# EAGLE design webradio (EAGLE 7.7.0)
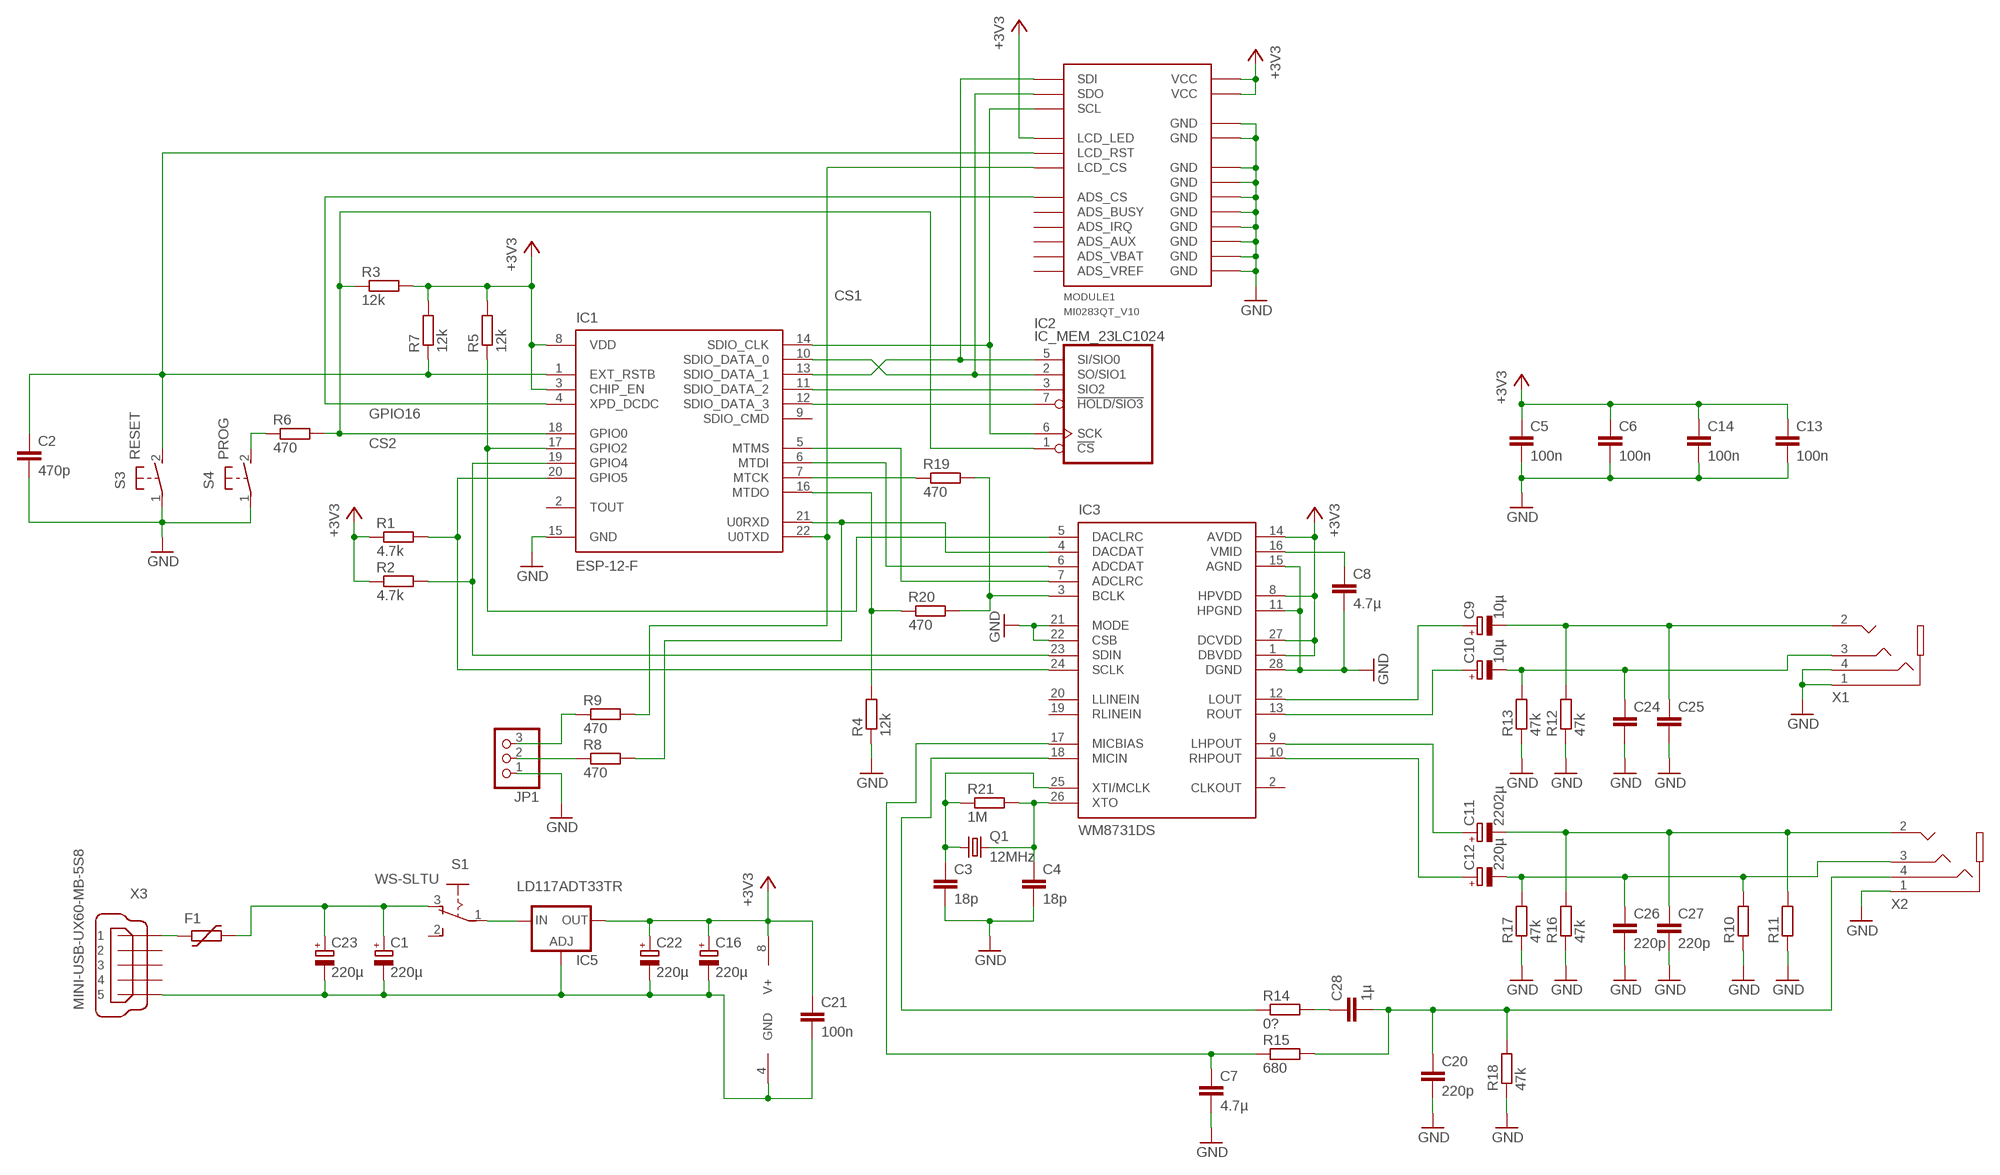
[diagram p0: schematic, sheet 1]

## Parts
C1  220µ  CPOL-EUB/3528-21R  [B/3528-21R]
C2  470p  C-EUC0805  [C0805]
C3  18p  C-EUC0805  [C0805]
C4  18p  C-EUC0805  [C0805]
C5  100n  C-EUC0805  [C0805]
C6  100n  C-EUC0805  [C0805]
C7  4.7µ  C-EUC0805  [C0805]
C8  4.7µ  C-EUC0805  [C0805]
C9  10µ  CPOL-EUA/3216-18R  [A/3216-18R]
C10  10µ  CPOL-EUA/3216-18R  [A/3216-18R]
C11  2202µ  CPOL-EUD/7343-31R  [D/7343-31R]
C12  220µ  CPOL-EUD/7343-31R  [D/7343-31R]
C13  100n  C-EUC0805  [C0805]
C14  100n  C-EUC0805  [C0805]
C16  220µ  CPOL-EUB/3528-21R  [B/3528-21R]
C20  220p  C-EUC0805  [C0805]
C21  100n  C-EUC0805  [C0805]
C22  220µ  CPOL-EUB/3528-21R  [B/3528-21R]
C23  220µ  CPOL-EUB/3528-21R  [B/3528-21R]
C24  C-EUC0805  [C0805]
C25  C-EUC0805  [C0805]
C26  220p  C-EUC0805  [C0805]
C27  220p  C-EUC0805  [C0805]
C28  1µ  C-EUC0805  [C0805]
F1  FUSE_PTC-1812  [PTC1812L]
IC1  ESP-12-F  [ESP-12-F]
IC2  IC_MEM_23LC1024  [SOIC-8]
IC3  WM8731DS  [SSOP28]
IC5  LD117ADT33TR  [DPACK]
JP1  PINHD-1X3/90  [1X03/90]
MODULE1  MI0283QT_V10  [MI0283QT_V10]
Q1  12MHz  CRYSTALHC49UP  [HC49UP]
R1  4.7k  R-EU_R0805  [R0805]
R2  4.7k  R-EU_R0805  [R0805]
R3  12k  R-EU_R0805  [R0805]
R4  12k  R-EU_R0805  [R0805]
R5  12k  R-EU_R0805  [R0805]
R6  470  R-EU_R0805  [R0805]
R7  12k  R-EU_R0805  [R0805]
R8  470  R-EU_R0805  [R0805]
R9  470  R-EU_R0805  [R0805]
R10  R-EU_R0805  [R0805]
R11  R-EU_R0805  [R0805]
R12  47k  R-EU_R0805  [R0805]
R13  47k  R-EU_R0805  [R0805]
R14  0?  R-EU_R0805  [R0805]
R15  680  R-EU_R0805  [R0805]
R16  47k  R-EU_R0805  [R0805]
R17  47k  R-EU_R0805  [R0805]
R18  47k  R-EU_R0805  [R0805]
R19  470  R-EU_R0805  [R0805]
R20  470  R-EU_R0805  [R0805]
R21  1M  R-EU_R0805  [R0805]
S1  WS-SLTU  [450302014072]
S3  RESET  31-XX  [B3F-31XX]
S4  PROG  31-XX  [B3F-31XX]
X1  SJ-43514-SMT  [SJ-43514-SMT]
X2  SJ-43514-SMT  [SJ-43514-SMT]
X3  MINI-USB-UX60-MB-5S8  [UX60-MB-5S8]

## Nets
+3V3: C5.1 C6.1 C13.1 C14.1 C16.+ C21.1 C22.+ IC1.3(CHIP_EN) IC1.8(VDD) IC2.8(V+) IC3.1(DBVDD) IC3.8(HPVDD) IC3.14(AVDD) IC3.27(DCVDD) IC5.4(OUT) MODULE1.3_VCC(VCC) MODULE1.4_VCC(VCC) MODULE1.5_LCD_LED(LCD_LED) R1.1 R2.1 R3.2 R5.2 R7.2
GND: C1.- C2.2 C3.2 C4.2 C5.2 C6.2 C7.2 C8.2 C13.2 C14.2 C16.- C20.2 C21.2 C22.- C23.- C24.2 C25.2 C26.2 C27.2 IC1.15(GND) IC2.4(GND) IC3.11(HPGND) IC3.15(AGND) IC3.21(MODE) IC3.22(CSB) IC3.28(DGND) IC5.1(ADJ) JP1.1 MODULE1.1_GND(GND) MODULE1.2_GND(GND) MODULE1.GND_1(GND) MODULE1.GND_2(GND) MODULE1.GND_3(GND) MODULE1.GND_4(GND) MODULE1.GND_5(GND) MODULE1.GND_6(GND) MODULE1.GND_7(GND) MODULE1.GND_8(GND) R4.1 R10.1 R11.1 R12.1 R13.1 R16.1 R17.1 R18.1 S3.1(P) S4.1(P) X1.1 X1.4 X2.1 X3.5
N$1: IC1.14(SDIO_CLK) IC2.6(SCK) MODULE1.10_SCL(SCL)
N$2: IC1.18(GPIO0) IC2.1(!CS) R3.1 R6.2
N$3: F1.1 X3.1
N$4: IC1.10(SDIO_DATA_0) IC2.2(SO/SIO1) MODULE1.9_SDO(SDO)
N$5: IC1.11(SDIO_DATA_2) IC2.3(SIO2)
N$6: IC1.12(SDIO_DATA_3) IC2.7(!HOLD/SIO3)
N$7: IC1.16(MTDO) R4.2 R20.1
N$8: IC1.21(U0RXD) IC3.4(DACDAT) R8.2
N$9: IC1.17(GPIO2) IC3.5(DACLRC) R5.1
N$10: IC1.19(GPIO4) IC3.23(SDIN) R2.2
N$11: IC1.20(GPIO5) IC3.24(SCLK) R1.2
N$12: R6.1 S4.2(S)
N$13: JP1.2 R8.1
N$14: C2.1 IC1.1(EXT_RSTB) MODULE1.6_LCD_RST(LCD_RST) R7.1 S3.2(S)
N$15: IC1.22(U0TXD) MODULE1.7_LCD_CS(LCD_CS) R9.2
N$16: JP1.3 R9.1
N$17: C3.1 IC3.25(XTI/MCLK) Q1.1 R21.1
N$18: C4.1 IC3.26(XTO) Q1.2 R21.2
N$19: C1.+ C23.+ F1.2 S1.3(O)
N$20: C8.1 IC3.16(VMID)
N$21: C10.+ IC3.13(ROUT)
N$22: C9.+ IC3.12(LOUT)
N$23: C9.- C25.1 R12.2 X1.2
N$24: C10.- C24.1 R13.2 X1.3
N$25: C12.+ IC3.10(RHPOUT)
N$26: C11.+ IC3.9(LHPOUT)
N$27: C11.- C27.1 R11.2 R16.2 X2.2
N$28: C12.- C26.1 R10.2 R17.2 X2.3
N$29: IC5.3(IN) S1.1(P)
N$30: C7.1 IC3.17(MICBIAS) R15.1
N$31: IC3.18(MICIN) R14.1
N$32: C28.1 R14.2
N$33: C20.1 C28.2 R15.2 R18.2 X2.4
N$34: IC1.6(MTDI) IC3.6(ADCDAT)
N$35: IC1.5(MTMS) IC3.7(ADCLRC)
N$37: IC1.7(MTCK) R19.1
N$38: IC3.3(BCLK) R19.2 R20.2
N$39: IC1.13(SDIO_DATA_1) IC2.5(SI/SIO0) MODULE1.8_SDI(SDI)
N$41: IC1.4(XPD_DCDC) MODULE1.11_ADS_CS(ADS_CS)
Unconnected: IC1.2(TOUT) IC1.9(SDIO_CMD) IC3.2(CLKOUT) IC3.19(RLINEIN) IC3.20(LLINEIN) MODULE1.12_ADS_BUSY(ADS_BUSY) MODULE1.13_ADS_IRQ(ADS_IRQ) MODULE1.14_ADS_AUX(ADS_AUX) MODULE1.15_ADS_VBAT(ADS_VBAT) MODULE1.16_ADS_VREF(ADS_VREF) S1.2(S) X3.2 X3.3 X3.4

## Notes on the sheet
- CS1
- GPIO16
- CS2

## Library data of the parts
C1 C9-C12 C16 C22 C23 = rcl:CPOL-EU: POLARIZED CAPACITOR, European symbol
C2-C8 C13 C14 C20 C21 C24-C28 = rcl:C-EU: CAPACITOR, European symbol
F1 = dp_devices:FUSE_PTC: Resettable PTC
IC1 = ai-thinker:ESP-12-F
IC2 = dp_devices:IC_MEM_23LC1024: 1Mbit SPI SRAM with Serial dual interface and Serial quad interface
IC3 = cirrus-logic-sven:WM8731
IC5 = v-reg:LD117A?*: Low drop fixed and adjustable positive voltage regulators 1 A Source: http://www.st.com/stonline/products/literature/ds/7194/ld1117axx.pdf
JP1 = pinhead:PINHD-1X3: PIN HEADER
MODULE1 = MI0283QT:MI0283QT_V10
Q1 = crystal:CRYSTAL: CRYSTAL; OC_FARNELL: unknown; OC_NEWARK: unknown
R1-R21 = rcl:R-EU_: RESISTOR, European symbol
S1 = switch-wuerth:WS-SLTU: WS-SLTU 10mmx2,5mm right angle mini Slide Swith, THT version, Opposite side connection
S3 S4 = switch-omron:31-XX: OMRON SWITCH
X1 X2 = con-cui:SJ-43514-SMT
X3 = con-hirose:MINI-USB-: MINI USB Connector Source: http://www.hirose.co.jp/cataloge_hp/e24000019.pdf; OC_FARNELL: unknown; OC_NEWARK: unknown

## Net classes
0 default: clearance 0.205 mm

## Board
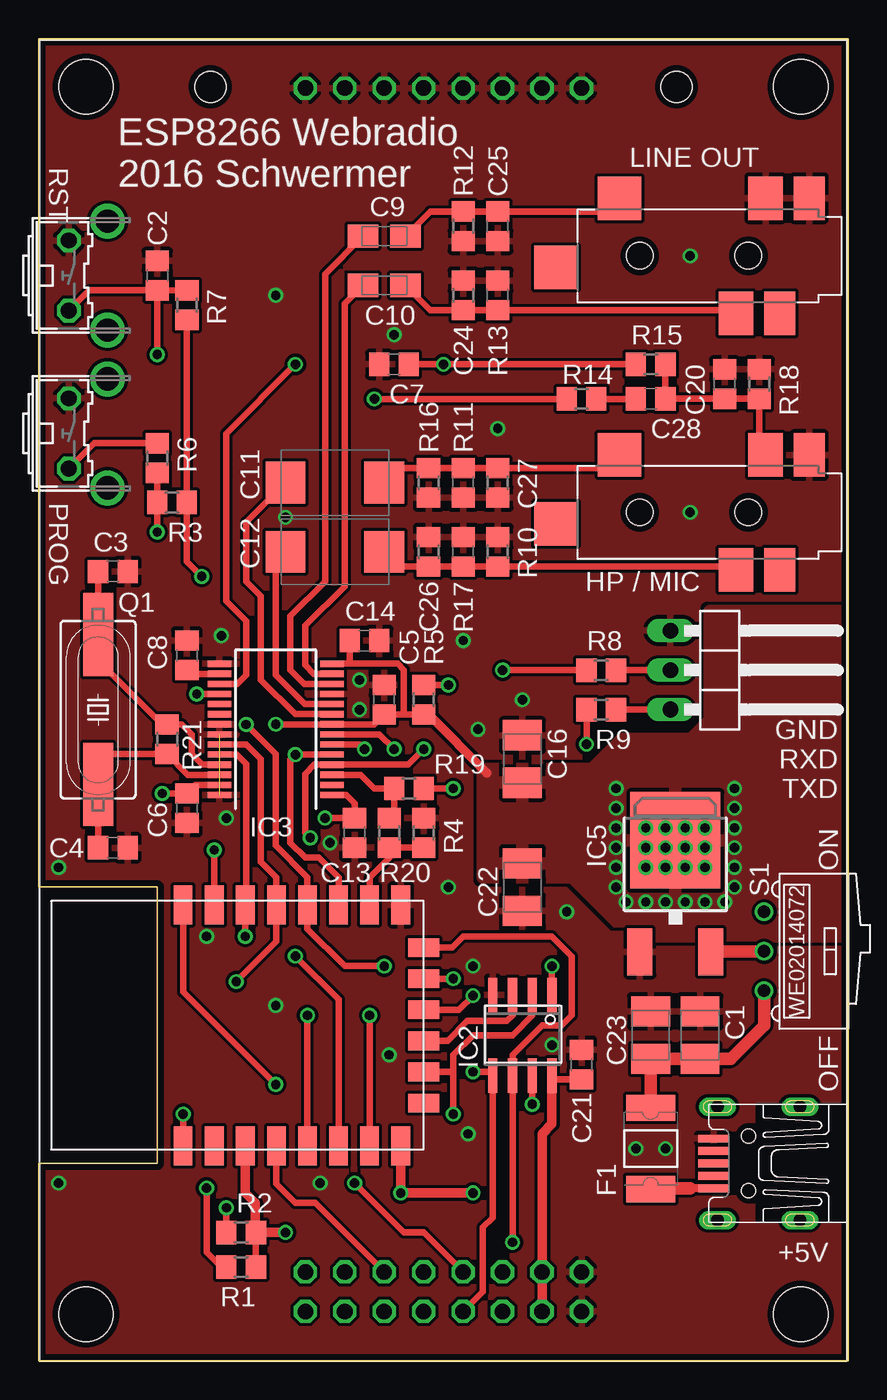
[diagram p1: board, top side]
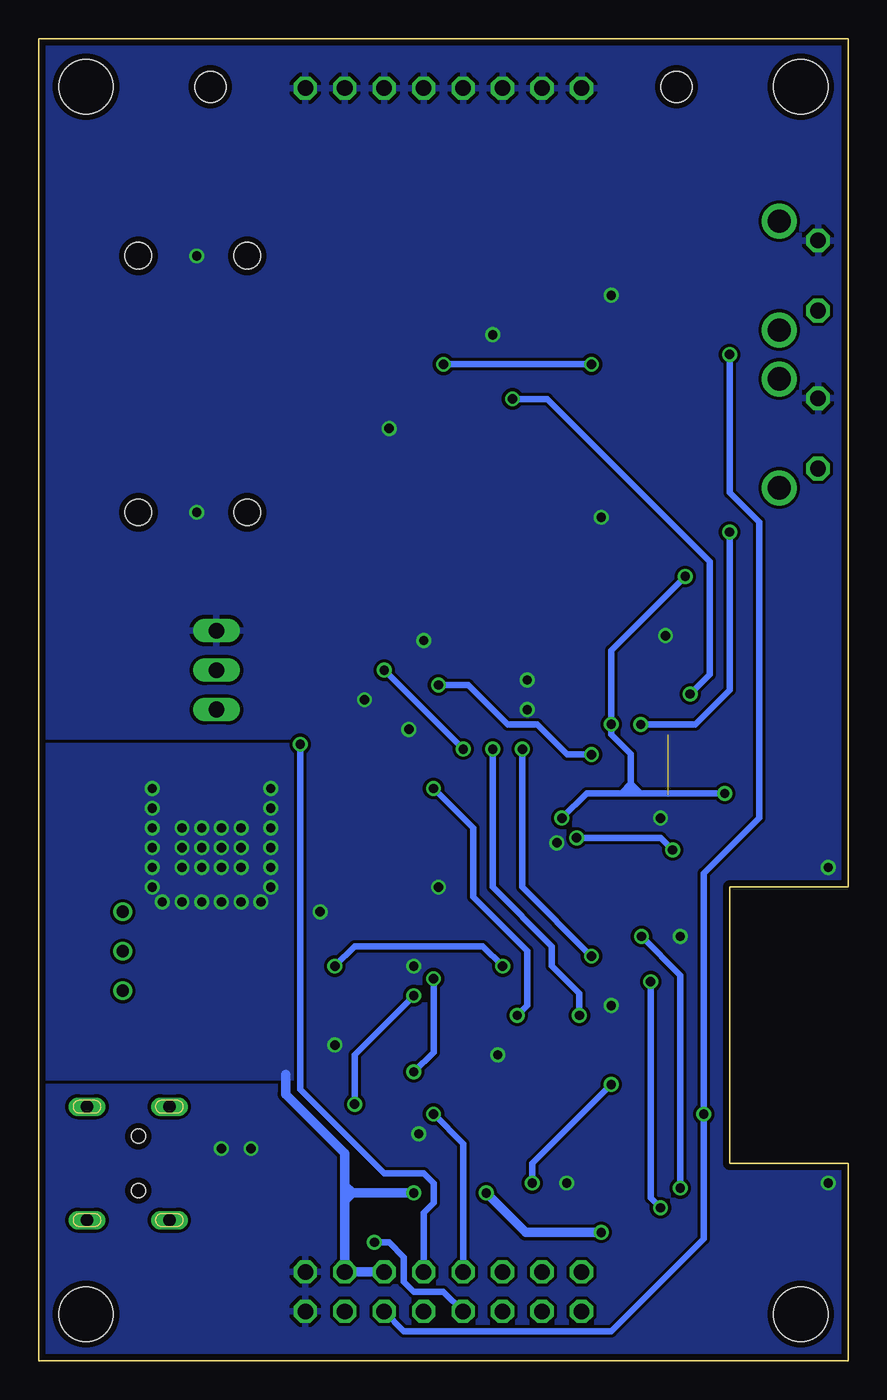
[diagram p2: board, bottom side, seen from below]

Size 52.07 x 85.09 mm. Coordinates in mm from the lower left corner, seen from the top.
Outline: 0,0 52.07,0 52.07,85.09 0,85.09 0,30.48 7.62,30.48 7.62,12.7 0,12.7 0,0
Copper layers (1*16): Top 0.0356mm / dielectric 1.5011mm / Bottom 0.0356mm
Design rules "osh_park": minimum track width 6mil, minimum drill 13mil, track to track 6mil, track to pad 6mil, pad to pad 6mil, via to via 6mil, smd to smd 6mil, copper to edge 15mil, drill to drill 6mil, minimum pad ring 7mil, minimum via ring 7mil, stop-mask expansion 3mil, vias tented up to drill 0mil, thermal gap 10mil

### Footprints (pad centres in the part's own frame; a part is rotated, then mirrored left to right if it is on the bottom)
B/3528-21R = smd 1.95 x 2.5: + 1.525,0; - -1.525,0
C0805 = smd 1.3 x 1.5: 1 -0.95,0; 2 0.95,0
A/3216-18R = smd 1.95 x 1.5: + 1.375,0; - -1.375,0
D/7343-31R = smd 2.55 x 2.7: + 3.175,0; - -3.175,0
PTC1812L = smd 1.7 x 3.15: 1 -2.62,0; 2 2.62,0
ESP-12-F = smd 2.5 x 1.2: 1 -7.75,15.48; 2 -7.75,13.48; 3 -7.75,11.48; 4 -7.75,9.48; 5 -7.75,7.48; 6 -7.75,5.48; 7 -7.75,3.48; 8 -7.75,1.48; 15 7.75,1.48; 16 7.75,3.48; 17 7.75,5.48; 18 7.75,7.48; 19 7.75,9.48; 20 7.75,11.48; 21 7.75,13.48; 22 7.75,15.48 | smd 1.2 x 2: 9 -5,0; 10 -3,0; 11 -1,0; 12 1,0; 13 3,0; 14 5,0
SOIC-8 = smd 0.6 x 2.2: 1 -1.905,-2.6; 2 -0.635,-2.6; 3 0.635,-2.6; 4 1.905,-2.6; 5 1.905,2.6; 6 0.635,2.6; 7 -0.635,2.6; 8 -1.905,2.6
SSOP28 = smd 0.4 x 1.5: 1 -4.225,-3.625; 2 -3.575,-3.625; 3 -2.925,-3.625; 4 -2.275,-3.625; 5 -1.625,-3.625; 6 -0.975,-3.625; 7 -0.325,-3.625; 8 0.325,-3.625; 9 0.975,-3.625; 10 1.625,-3.625; 11 2.275,-3.625; 12 2.925,-3.625; 13 3.575,-3.625; 14 4.225,-3.625; 15 4.225,3.625; 16 3.575,3.625; 17 2.925,3.625; 18 2.275,3.625; 19 1.625,3.625; 20 0.975,3.625; 21 0.325,3.625; 22 -0.325,3.625; 23 -0.975,3.625; 24 -1.625,3.625; 25 -2.275,3.625; 26 -2.925,3.625; 27 -3.575,3.625; 28 -4.225,3.625
DPACK = smd 1.6 x 3: 1 -2.28,-4.8; 3 2.28,-4.8 | smd 5.8 x 6.2: 4 0,2.38
1X03/90 = drill 1.016 long: 1 -2.54,-3.81; 2 0,-3.81; 3 2.54,-3.81
MI0283QT_V10 = drill 1 octagon: 1_GND 8.89,5.715; 2_GND 8.89,3.175; 3_VCC 6.35,5.715; 4_VCC 6.35,3.175; 5_LCD_LED 3.81,5.715; 6_LCD_RST 3.81,3.175; 7_LCD_CS 1.27,5.715; 8_SDI 1.27,3.175; 9_SDO -1.27,5.715; 10_SCL -1.27,3.175; 11_ADS_CS -3.81,5.715; 12_ADS_BUSY -3.81,3.175; 13_ADS_IRQ -6.35,5.715; 14_ADS_AUX -6.35,3.175; 15_ADS_VBAT -8.89,5.715; 16_ADS_VREF -8.89,3.175; GND_1 8.89,81.915; GND_2 6.35,81.915; GND_3 3.81,81.915; GND_4 1.27,81.915; GND_5 -1.27,81.915; GND_6 -3.81,81.915; GND_7 -6.35,81.915; GND_8 -8.89,81.915 | hole 3.5: -23,82; 23,82; -23,3; 23,3 | hole 2: -15,82; 15,82
HC49UP = smd 5.334 x 1.93: 1 -4.826,0; 2 4.826,0
R0805 = smd 1.3 x 1.5: 1 -0.95,0; 2 0.95,0
450302014072 = drill 0.8: 1 0,0; 2 -2.54,0; 3 2.54,0
B3F-31XX = drill 1.016 octagon: 1 -2.261,-1.245; 2 2.261,-1.245 | drill 1.499 pad 2.159: 3 -3.505,1.245; 4 3.505,1.245
SJ-43514-SMT = smd 2 x 2.8: 1 0.6,-3.7; 6 2.5,3.7 | smd 2.8 x 2.8: 2 12.8,-3.7; 5 16.9,0.75 | smd 2.2 x 2.8: 3 5.3,3.7; 4 3.4,-3.7 | hole 1.7: 4.5,0; 11.5,0
UX60-MB-5S8 = smd 2 x 0.5: 1 8.65,1.6; 2 8.65,0.8; 3 8.65,0; 4 8.65,-0.8; 5 8.65,-1.6 | drill 0.8 long: M1 3.1,-3.65; M2 3.1,3.65; M3 8.4,3.65; M4 8.4,-3.65 | hole 0.9: 6.4,-1.75; 6.4,1.75

### Placement (x,y rotation side)
C1  42.55,20.95 270 top
C2  7.62,69.85 90 top
C3  4.76,50.8 0 top
C4  4.76,33.02 0 top
C5  22.23,42.55 90 top
C6  9.53,35.56 270 top
C7  22.86,64.14 180 top
C8  9.53,45.4 90 top
C9  22.23,72.39 180 top
C10  22.23,69.22 180 top
C11  19.05,56.52 180 top
C12  19.05,52.07 180 top
C13  20.32,33.97 270 top
C14  20.95,46.35 0 top
C16  31.11,38.73 270 top
C20  44.13,62.87 90 top
C21  34.92,19.05 90 top
C22  31.11,30.48 90 top
C23  39.37,20.95 270 top
C24  29.53,68.58 90 top
C25  29.53,73.03 270 top
C26  27.3,52.07 90 top
C27  27.3,56.52 270 top
C28  39.37,61.91 0 top
F1  39.37,13.65 90 top
IC1  24.77,21.59 90 top
IC2  31.11,20.95 180 top
IC3  15.24,40.64 90 top
IC5  40.96,31.11 0 top
JP1  44.45,44.45 270 top
MODULE1  26.04,0 0 top
Q1  3.81,41.91 270 top
R1  13.02,6.03 180 top
R2  13.02,8.26 180 top
R3  8.57,55.24 0 top
R4  24.77,33.97 270 top
R5  24.77,42.55 270 top
R6  7.62,58.1 270 top
R7  9.53,67.94 270 top
R8  36.2,44.45 180 top
R9  36.2,41.91 180 top
R10  29.53,52.07 270 top
R11  29.53,56.52 90 top
R12  27.3,73.03 90 top
R13  27.3,68.58 270 top
R14  34.92,61.91 0 top
R15  39.37,64.14 0 top
R16  25.08,56.52 90 top
R17  25.08,52.07 270 top
R18  46.35,62.87 270 top
R19  23.81,36.83 180 top
R20  22.54,33.97 90 top
R21  8.26,40.01 270 top
S1  46.67,26.35 270 top
S3  3.17,69.85 270 top
S4  3.17,59.69 270 top
X1  50.16,71.12 180 top
X2  50.16,54.61 180 top
X3  52.07,12.7 180 top

### Tracks (layer width: path | path; a pad name or v marks a point on that pad's centre or on a via)
+3V3  (via drill 0.6)
  Top 0.406: IC3.27 10.08,37.06 C6.1 v7.94,36.51 | 19.37,44.87 IC3.14 20,44.87 | 23.5,41.59 C5.1 21.59,40.97 IC3.8 v15.24,40.97 | 23.5,41.59 R5.2 | 13.92,8.3 R2.1 R1.1 | 20,44.87 23.08,44.87 23.5,44.45 23.5,41.59 | C21.1 33.02,18.1 IC2.8 | C14.1 20,44.87 | R7.2 R3.2 9.53,51.44 v10.48,50.48 | IC3.1 19.78,36.41 20.32,35.88 C13.1 v18.41,34.92
  Top 0.61: IC1.8 v23.29,10.79 v27.94,10.79 | IC1.3 13.29,10.79 13.92,10.16 13.92,8.3 | MODULE1.4_VCC MODULE1.3_VCC 32.38,14.61 33.02,15.24 IC2.8 | R5.2 25.08,41.59 28.83,37.84 | v15.88,8.26 R2.1
  Bottom 0.406: v18.41,34.92 16.83,36.51 14.61,36.51 | 14.61,36.51 13.97,36.51 | 13.97,36.51 13.34,36.51 | 13.34,36.51 v7.94,36.51 | 13.97,37.15 13.97,39.05 15.24,40.32 v15.24,40.97 15.24,45.72 v10.48,50.48 | 13.97,37.15 13.97,36.51 | 13.34,36.51 13.97,37.15 | 13.97,37.15 14.61,36.51 | 32.38,10.16 31.75,10.79 32.38,11.43
  Bottom 0.61: v27.94,10.79 31.75,10.79 32.38,10.79 | 32.38,10.79 32.38,10.16 MODULE1.3_VCC MODULE1.5_LCD_LED | 36.2,18.41 36.2,17.14 32.38,13.34 32.38,11.43 32.38,10.79 | v23.29,10.79 20.75,8.26 v15.88,8.26
  other vias: 39.05,31.75 40.32,31.75 41.59,31.75 42.86,31.75 42.86,33.02 41.59,33.02 40.32,33.02 39.05,33.02 39.05,34.29 40.32,34.29 41.59,34.29 42.86,34.29 37.15,34.29 37.15,31.75 37.15,35.56 39.05,29.53 40.32,29.53 44.77,33.02 41.59,29.53 42.86,29.53 44.77,34.29 44.77,31.75 44.77,35.56 37.15,33.02 44.77,30.48 44.77,36.83 37.15,36.83 37.15,30.48 37.78,29.53 44.13,29.53
  pour Top: 38.1,27.3 52.07,27.3 52.07,48.26 43.18,48.26 43.18,41.27 41.91,40.01 37.47,40.01 35.56,38.1 28.57,38.1 28.57,31.11 34.29,31.11
  pour Bottom: 35.56,39.37 52.07,39.37 52.07,18.41 35.56,18.41
GND  (via drill 0.6)  (1 unrouted)
  other vias: 12.06,34.92 1.27,31.75 20.64,43.81 15.24,68.58 20.64,41.91 27.94,25.4 33.02,20.32 18.73,33.34 1.27,11.43 41.91,71.12 41.91,54.61 29.53,60.01 22.86,66.04 15.88,54.29 11.75,46.67 10.79,27.3 15.24,22.86 22.54,19.68 27.62,14.61 18.1,11.43 26.35,30.48 40.32,13.65 38.42,13.65 33.97,28.89 28.26,40.64 31.11,42.55 27.3,46.35
  pour Top (rank 2): 0,85.09 52.07,85.09 52.07,0 0,0
  pour Bottom (rank 2): 0,85.09 52.07,85.09 52.07,0 0,0
N$1  (via drill 0.6)
  Top 0.406: IC1.14 26.59,26.59 27.3,27.3 33.02,27.3 34.29,26.04 34.29,22.23 33.66,21.59 32.38,21.59 30.48,19.68 IC2.6 v30.48,7.62
  Bottom 0.406: v30.48,7.62 29.53,7.62 28.57,6.67 28.57,5.08 27.94,4.45 26.04,4.45 MODULE1.10_SCL
N$2  (via drill 0.6)
  Top 0.406: IC2.1 v33.02,25.4 | v22.23,25.4 19.68,25.4 17.29,27.8 IC1.18 17.29,31.11 15.24,33.16 15.24,39.05 v13.34,40.96 | R6.2 R3.1 v7.62,53.34
  Bottom 0.406: v22.23,25.4 23.5,26.67 31.75,26.67 v33.02,25.4 | v13.34,40.96 9.84,40.96 7.62,43.18 v7.62,53.34
N$3
  Top 0.5: X3.1 41.91,11.1
  Top 0.813: 41.91,11.1 39.37,11.1 F1.1
N$4  (via drill 0.6)
  Top 0.406: IC1.10 26.67,18.59 | IC2.2 31.75,22.23 30.48,20.95 27.94,20.95 26.67,19.68 26.67,18.59 | v26.67,15.88 26.67,18.59
  Bottom 0.406: MODULE1.9_SDO 24.77,13.97 v26.67,15.88
N$5
  Top 0.406: IC2.3 30.48,22.23 30.11,21.86 27.57,21.86 26.3,20.59 IC1.11
N$6  (via drill 0.6)
  Top 0.406: v31.75,16.51 IC2.7 | IC1.12 27.04,22.59 v27.94,23.5
  Bottom 0.406: v27.94,23.5 31.75,19.68 v31.75,16.51
N$7
  Top 0.406: R4.2 R20.1 22.54,32.37 21.29,31.11 IC1.16
N$8  (via drill 0.6)
  Top 0.406: IC1.21 v11.29,32.88 | v17.46,33.66 17.14,33.97 17.14,37.78 17.73,38.37 IC3.4 23.76,38.37 v24.77,39.37 | R8.2 v29.84,44.45
  Bottom 0.406: v11.29,32.88 12.06,33.66 v17.46,33.66 | v29.84,44.45 v24.77,39.37
N$9  (via drill 0.6)
  Top 0.406: IC3.5 v16.51,39.02 16.19,38.7 16.19,33.34 17.14,32.38 18.02,32.38 19.29,31.11 IC1.17 | R5.1 v26.35,43.5
  Bottom 0.406: v26.35,43.5 24.45,43.5 21.91,40.96 20,40.96 18.06,39.02 v16.51,39.02
N$10  (via drill 0.6)
  Top 0.406: IC3.23 13.36,39.66 14.29,38.73 14.29,32.11 15.29,31.11 IC1.19 15.29,26.99 v12.7,24.4 | v12.06,9.84 R2.2
  Bottom 0.406: v12.7,24.4 12.7,10.48 v12.06,9.84
N$11  (via drill 0.6)
  Top 0.406: IC3.24 12.74,39.02 13.34,38.42 13.34,29.64 IC1.20 v13.29,27.3 | v10.79,11.11 10.79,6.99 11.75,6.03 R1.2
  Bottom 0.406: v13.29,27.3 10.79,24.82 v10.79,11.11
N$12
  Top 0.406: S4.2 3.55,59.05 R6.1
N$13
  Top 0.406: R8.1 JP1.2
N$14  (via drill 0.6)
  Top 0.406: S3.2 3.24,68.9 C2.1 | C2.1 R7.1 | IC1.1 v9.29,15.88 | v7.62,64.77 C2.1
  Bottom 0.406: v7.62,64.77 7.62,55.88 5.71,53.98 5.71,34.92 9.29,31.36 v9.29,15.88 9.29,7.86 15.24,1.91 28.57,1.91 MODULE1.6_LCD_RST
N$15  (via drill 0.6)
  Top 0.406: IC1.22 9.29,23.73 v15.24,17.78 | v20.32,11.43 23.5,8.26 24.77,8.26 MODULE1.7_LCD_CS | R9.2 v35.24,39.69
  Bottom 0.406: v15.24,17.78 20.32,12.7 v20.32,11.43 | MODULE1.7_LCD_CS 27.3,9.53 26.67,10.16 26.67,11.43 27.3,12.06 29.84,12.06 35.24,17.46 v35.24,39.68 v35.24,39.69
N$16
  Top 0.406: R9.1 JP1.3
N$17
  Top 0.406: IC3.25 10.53,38.37 9.84,39.05 9.84,40.32 9.21,40.96 R21.1 | R21.1 | C3.1 Q1.1 3.81,45.09 7.94,40.96 R21.1
N$18
  Top 0.406: IC3.26 9.6,37.72 R21.2 4.13,39.05 3.81,38.73 Q1.2 C4.1
N$19
  Top 0.813: F1.2 C23.+ C1.+ 44.51,19.43 46.67,21.59 S1.3
N$20
  Top 0.406: IC3.16 10.08,44.22 C8.1
N$21
  Top 0.406: IC3.13 17.7,44.22 17.14,44.77 17.14,47.31 19.68,49.85 19.68,68.05 C10.+
N$22
  Top 0.406: IC3.12 17.08,43.56 16.19,44.45 16.19,47.94 18.41,50.16 18.41,69.95 C9.+
N$23
  Top 0.406: C9.- 25.18,73.97 R12.2 C25.1 36.52,73.97 X1.2
N$24
  Top 0.406: C10.- 25.18,67.63 R13.2 C24.1 44.66,67.63 X1.3
N$25
  Top 0.406: IC3.10 17.11,42.27 15.24,44.13 15.24,51.44 C12.+
N$26
  Top 0.406: IC3.9 16.49,41.62 14.29,43.81 14.29,49.21 13.34,50.16 13.34,53.98 C11.+
N$27
  Top 0.406: C11.- 23.18,57.47 R16.2 C27.1 R11.2 36.52,57.47 X2.2
N$28
  Top 0.406: C12.- 23.18,51.12 R17.2 C26.1 R10.2 44.66,51.12 X2.3
N$29
  Top 0.61: 43.24,26.04 IC5.3
  Top 0.813: 43.26,26.29 IC5.3 43.24,26.35 S1.1
N$30  (via drill 0.6)
  Top 0.406: IC3.17 12.77,43.56 13.34,44.13 13.34,47.62 12.06,48.9 12.06,59.69 v16.51,64.14 | C7.1 v26.04,64.14 R15.1
  Bottom 0.406: v16.51,64.14 v26.04,64.14
N$31  (via drill 0.6)
  Top 0.406: R14.1 v21.59,61.91 | IC3.18 v10.16,42.91
  Bottom 0.406: v21.59,61.91 19.37,61.91 8.89,51.44 8.89,44.19 v10.16,42.91
N$32
  Top 0.406: C28.1 R14.2
N$33
  Top 0.406: X2.4 46.35,58.72 R18.2 C20.1 C28.2 R15.2
N$34  (via drill 0.6)
  Top 0.406: IC3.6 20.66,39.66 v20.95,39.37 | IC1.6 19.29,23.26 v16.51,26.04
  Bottom 0.406: v20.95,39.37 20.95,30.48 v16.51,26.04
N$35  (via drill 0.6)
  Top 0.406: IC3.7 21.91,40.31 v22.86,39.37 | IC1.5 v17.29,22.23
  Bottom 0.406: v22.86,39.37 22.86,30.48 19.05,26.67 19.05,25.4 17.29,23.64 v17.29,22.23
N$37  (via drill 0.6)
  Top 0.406: v26.67,36.83 R19.1 | IC1.7 v21.29,22.23
  Bottom 0.406: v26.67,36.83 24.13,34.29 24.13,29.84 20.65,26.36 20.65,22.86 v21.29,22.23
N$38
  Top 0.406: R20.2 22.86,34.6 R19.2 21.59,36.83 20.7,37.72 IC3.3
N$39  (via drill 0.6)
  Top 0.406: MODULE1.8_SDI 28.57,4.45 28.57,8.57 29.21,9.21 IC2.5 29.21,18.59 v27.94,18.59 | IC1.13 v26.67,24.59
  Bottom 0.406: v27.94,18.59 26.67,19.86 v26.67,24.59
N$41
  Top 0.406: MODULE1.11_ADS_CS 17.78,10.16 16.51,10.16 15.29,11.38 IC1.4

### Text on the board
tNames: LINE OUT | RST | ESP8266 Webradio / 2016 Schwermer | PROG | HP / MIC | GND / RXD / TXD | ON | IC2 | OFF | F1 | +5V